# Altium schematic sheet AMC.SchDoc: AMC
size 420 x 297 mm; DocumentNumber: 1; SheetNumber: 7; SheetTotal: 15
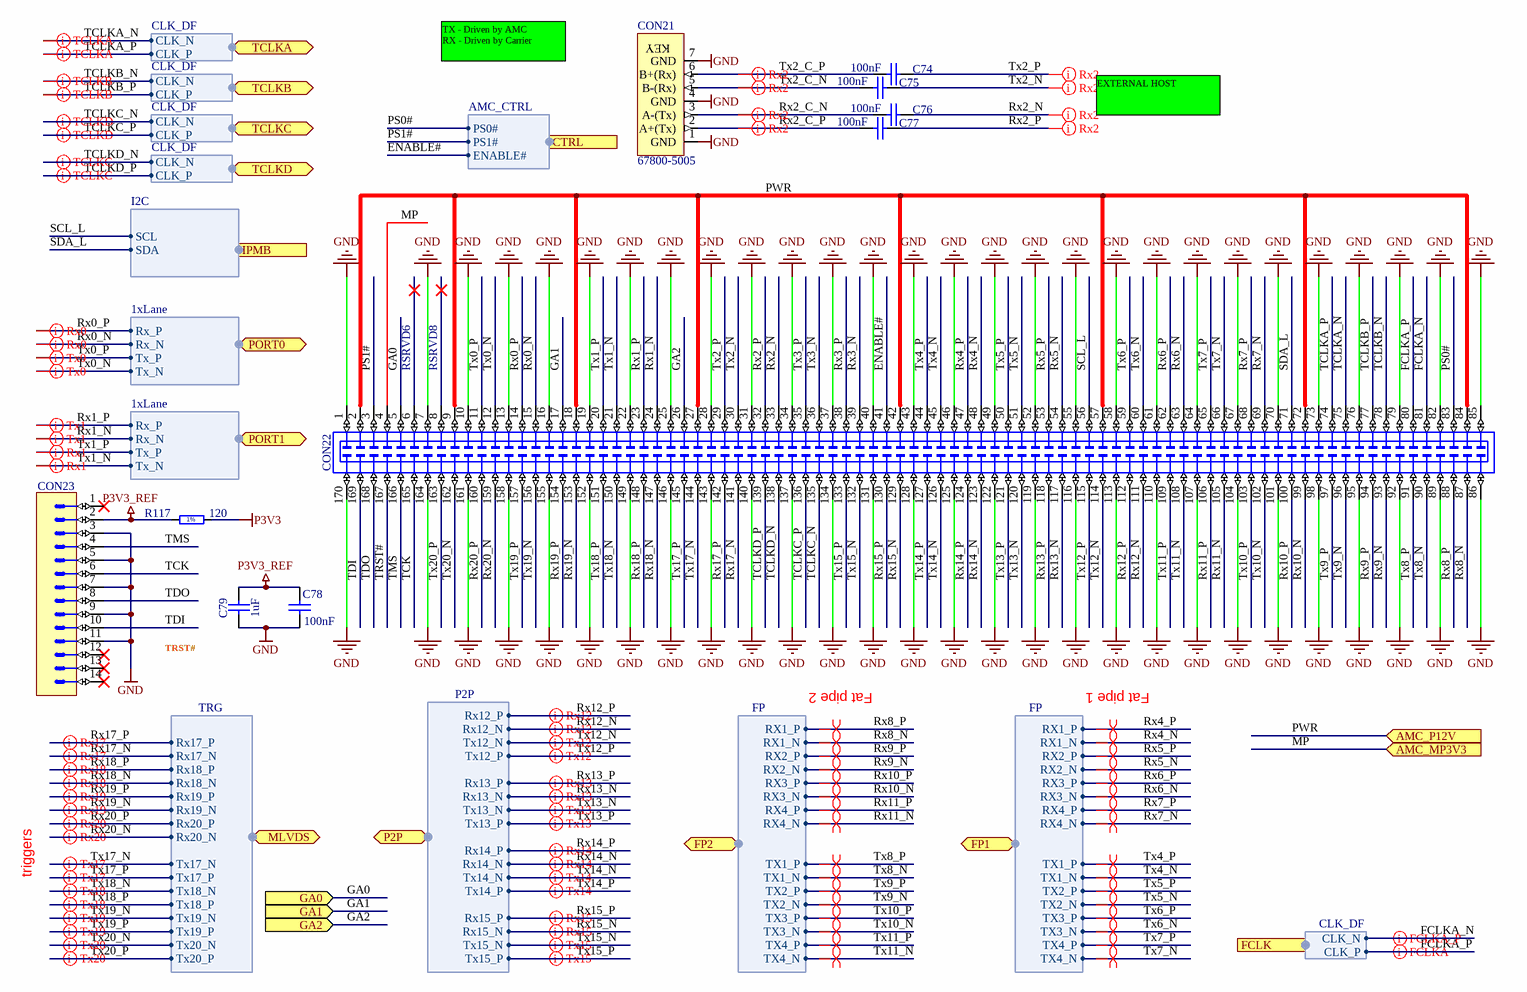
[diagram p0: AMC.SchDoc]

## Parts
C74  100nF  [CAPC0603X33N]
C75  100nF  [CAPC0603X33N]
C76  100nF  [CAPC0603X33N]
C77  100nF  [CAPC0603X33N]
C78  100nF  [CAPC0603X33N]
C79  1uF  [CAPC1608X87N]
CON21  67800-5005  [CON_SATA_V]
CON22  SAMTEC_MTCA-085-02-S-DV-SMT-K-TR  [SAMTEC_MTCA-085-02-S-DV-SMT-K-TR]  (value not drawn)
CON23  MOLEX_87832-1420  [MOLEX_87832-1420]  (value not drawn)
R117  120  [RESC1005X40N]

## Ports
AMC_MP3V3 (in), AMC_P12V (in), CTRL (harness AMC_CTRL), FCLK (harness CLK_DF), FP1 (harness FP), FP2 (harness FP), GA0 (in), GA1 (in), GA2 (in), IPMB (harness I2C), MLVDS (harness TRG), P2P (harness P2P), PORT0 (harness 1xLane), PORT1 (harness 1xLane), TCLKA (harness CLK_DF), TCLKB (harness CLK_DF), TCLKC (harness CLK_DF), TCLKD (harness CLK_DF)

## Harnesses
TRG: Rx17_P, Rx17_N, Rx18_P, Rx18_N, Rx19_P, Rx19_N, Rx20_P, Rx20_N, Tx17_N, Tx17_P, Tx18_N, Tx18_P, Tx19_N, Tx19_P, Tx20_N, Tx20_P
1xLane: Rx_P, Rx_N, Tx_P, Tx_N
FP: RX1_P, RX1_N, RX2_N, RX2_P, TX1_P, TX1_N, TX2_N, TX2_P, RX3_P, RX3_N, RX4_N, RX4_P, TX3_P, TX3_N, TX4_N, TX4_P
I2C: SCL, SDA
P2P: Rx12_P, Rx12_N, Tx12_N, Tx12_P, Rx13_P, Rx13_N, Tx13_N, Tx13_P, Rx14_P, Rx14_N, Tx14_N, Tx14_P, Rx15_P, Rx15_N, Tx15_N, Tx15_P
CLK_DF: CLK_P, CLK_N
AMC_CTRL: PS0#, PS1#, ENABLE#

## Nets
GND: C78.1 C79.1 CON21.1(GND) CON21.4(GND) CON21.7(GND) CON22.1 CON22.7 CON22.10 CON22.13 CON22.16 CON22.19 CON22.22 CON22.25 CON22.28 CON22.31 CON22.34 CON22.37 CON22.40 CON22.43 CON22.46 CON22.49 CON22.52 CON22.55 CON22.58 CON22.61 CON22.64 CON22.67 CON22.70 CON22.73 CON22.76 CON22.79 CON22.82 CON22.85 CON22.86 CON22.89 CON22.92 CON22.95 CON22.98 CON22.101 CON22.104 CON22.107 CON22.110 CON22.113 CON22.116 CON22.119 CON22.122 CON22.125 CON22.128 CON22.131 CON22.134 CON22.137 CON22.140 CON22.143 CON22.146 CON22.149 CON22.152 CON22.155 CON22.158 CON22.161 CON22.164 CON22.170 CON23.3 CON23.5 CON23.7 CON23.9 CON23.11
P3V3: R117.2
P3V3_REF: C78.2 C79.2 CON23.2 R117.1
ENABLE#: CON22.41 ; port CTRL.ENABLE#
FCLKA_N: CON22.81 ; port FCLK.CLK_N
FCLKA_P: CON22.80 ; port FCLK.CLK_P
GA0: CON22.5 ; port GA0
GA1: CON22.17 ; port GA1
GA2: CON22.26 ; port GA2
MP: CON22.4 ; port AMC_MP3V3
PS0#: CON22.83 ; port CTRL.PS0#
PS1#: CON22.3 ; port CTRL.PS1#
PWR: CON22.2 CON22.9 CON22.18 CON22.27 CON22.42 CON22.57 CON22.72 CON22.84 ; port AMC_P12V
Rx0_N: CON22.15 ; port PORT0.Rx_N
Rx0_P: CON22.14 ; port PORT0.Rx_P
Rx1_N: CON22.24 ; port PORT1.Rx_N
Rx1_P: CON22.23 ; port PORT1.Rx_P
Rx2_C_N: C76.1 CON21.3(A-(Tx))
Rx2_C_P: C77.1 CON21.2(A+(Tx))
Rx2_N: C76.2 CON22.33
Rx2_P: C77.2 CON22.32
Rx3_N: CON22.39
Rx3_P: CON22.38
Rx4_N: CON22.48 ; port FP1.RX1_N
Rx4_P: CON22.47 ; port FP1.RX1_P
Rx5_N: CON22.54 ; port FP1.RX2_N
Rx5_P: CON22.53 ; port FP1.RX2_P
Rx6_N: CON22.63 ; port FP1.RX3_N
Rx6_P: CON22.62 ; port FP1.RX3_P
Rx7_N: CON22.69 ; port FP1.RX4_N
Rx7_P: CON22.68 ; port FP1.RX4_P
Rx8_N: CON22.87 ; port FP2.RX1_N
Rx8_P: CON22.88 ; port FP2.RX1_P
Rx9_N: CON22.93 ; port FP2.RX2_N
Rx9_P: CON22.94 ; port FP2.RX2_P
Rx10_N: CON22.99 ; port FP2.RX3_N
Rx10_P: CON22.100 ; port FP2.RX3_P
Rx11_N: CON22.105 ; port FP2.RX4_N
Rx11_P: CON22.106 ; port FP2.RX4_P
Rx12_N: CON22.111 ; port P2P.Rx12_N
Rx12_P: CON22.112 ; port P2P.Rx12_P
Rx13_N: CON22.117 ; port P2P.Rx13_N
Rx13_P: CON22.118 ; port P2P.Rx13_P
Rx14_N: CON22.123 ; port P2P.Rx14_N
Rx14_P: CON22.124 ; port P2P.Rx14_P
Rx15_N: CON22.129 ; port P2P.Rx15_N
Rx15_P: CON22.130 ; port P2P.Rx15_P
Rx17_N: CON22.141 ; port MLVDS.Rx17_N
Rx17_P: CON22.142 ; port MLVDS.Rx17_P
Rx18_N: CON22.147 ; port MLVDS.Rx18_N
Rx18_P: CON22.148 ; port MLVDS.Rx18_P
Rx19_N: CON22.153 ; port MLVDS.Rx19_N
Rx19_P: CON22.154 ; port MLVDS.Rx19_P
Rx20_N: CON22.159 ; port MLVDS.Rx20_N
Rx20_P: CON22.160 ; port MLVDS.Rx20_P
SCL_L: CON22.56 ; port IPMB.SCL
SDA_L: CON22.71 ; port IPMB.SDA
TCK: CON22.165 CON23.6
TCLKA_N: CON22.75 ; port TCLKA.CLK_N
TCLKA_P: CON22.74 ; port TCLKA.CLK_P
TCLKB_N: CON22.78 ; port TCLKB.CLK_N
TCLKB_P: CON22.77 ; port TCLKB.CLK_P
TCLKC_N: CON22.135 ; port TCLKC.CLK_N
TCLKC_P: CON22.136 ; port TCLKC.CLK_P
TCLKD_N: CON22.138 ; port TCLKD.CLK_N
TCLKD_P: CON22.139 ; port TCLKD.CLK_P
TDI: CON22.169 CON23.10
TDO: CON22.168 CON23.8
TMS: CON22.166 CON23.4
TRST#: CON22.167
Tx0_N: CON22.12 ; port PORT0.Tx_N
Tx0_P: CON22.11 ; port PORT0.Tx_P
Tx1_N: CON22.21 ; port PORT1.Tx_N
Tx1_P: CON22.20 ; port PORT1.Tx_P
Tx2_C_N: C75.1 CON21.5(B-(Rx))
Tx2_C_P: C74.1 CON21.6(B+(Rx))
Tx2_N: C75.2 CON22.30
Tx2_P: C74.2 CON22.29
Tx3_N: CON22.36
Tx3_P: CON22.35
Tx4_N: CON22.45 ; port FP1.TX1_N
Tx4_P: CON22.44 ; port FP1.TX1_P
Tx5_N: CON22.51 ; port FP1.TX2_N
Tx5_P: CON22.50 ; port FP1.TX2_P
Tx6_N: CON22.60 ; port FP1.TX3_N
Tx6_P: CON22.59 ; port FP1.TX3_P
Tx7_N: CON22.66 ; port FP1.TX4_N
Tx7_P: CON22.65 ; port FP1.TX4_P
Tx8_N: CON22.90 ; port FP2.TX1_N
Tx8_P: CON22.91 ; port FP2.TX1_P
Tx9_N: CON22.96 ; port FP2.TX2_N
Tx9_P: CON22.97 ; port FP2.TX2_P
Tx10_N: CON22.102 ; port FP2.TX3_N
Tx10_P: CON22.103 ; port FP2.TX3_P
Tx11_N: CON22.108 ; port FP2.TX4_N
Tx11_P: CON22.109 ; port FP2.TX4_P
Tx12_N: CON22.114 ; port P2P.Tx12_N
Tx12_P: CON22.115 ; port P2P.Tx12_P
Tx13_N: CON22.120 ; port P2P.Tx13_N
Tx13_P: CON22.121 ; port P2P.Tx13_P
Tx14_N: CON22.126 ; port P2P.Tx14_N
Tx14_P: CON22.127 ; port P2P.Tx14_P
Tx15_N: CON22.132 ; port P2P.Tx15_N
Tx15_P: CON22.133 ; port P2P.Tx15_P
Tx17_N: CON22.144 ; port MLVDS.Tx17_N
Tx17_P: CON22.145 ; port MLVDS.Tx17_P
Tx18_N: CON22.150 ; port MLVDS.Tx18_N
Tx18_P: CON22.151 ; port MLVDS.Tx18_P
Tx19_N: CON22.156 ; port MLVDS.Tx19_N
Tx19_P: CON22.157 ; port MLVDS.Tx19_P
Tx20_N: CON22.162 ; port MLVDS.Tx20_N
Tx20_P: CON22.163 ; port MLVDS.Tx20_P

Not connected (* = marked no-connect by the designer): CON22 6* 8*; CON23 1* 12* 13* 14*

## Layout directives
differential pair: FCLKA_N, FCLKA_P, Rx0_N, Rx0_P, Rx1_N, Rx1_P, Rx2_C_N, Rx2_C_P, Rx2_N, Rx2_P, Rx4_N, Rx4_P, Rx5_N, Rx5_P, Rx6_N, Rx6_P, Rx7_N, Rx7_P, Rx8_N, Rx8_P, Rx9_N, Rx9_P, Rx10_N, Rx10_P, Rx11_N, Rx11_P, Rx12_N, Rx12_P, Rx13_N, Rx13_P, Rx14_N, Rx14_P, Rx15_N, Rx15_P, Rx17_N, Rx17_P, Rx18_N, Rx18_P, Rx19_N, Rx19_P, Rx20_N, Rx20_P, TCLKA_N, TCLKA_P, TCLKB_N, TCLKB_P, TCLKC_N, TCLKC_P, TCLKD_N, TCLKD_P, Tx0_N, Tx0_P, Tx1_N, Tx1_P, Tx2_C_N, Tx2_C_P, Tx2_N, Tx2_P, Tx4_N, Tx4_P, Tx5_N, Tx5_P, Tx6_N, Tx6_P, Tx7_N, Tx7_P, Tx8_N, Tx8_P, Tx9_N, Tx9_P, Tx10_N, Tx10_P, Tx11_N, Tx11_P, Tx12_N, Tx12_P, Tx13_N, Tx13_P, Tx14_N, Tx14_P, Tx15_N, Tx15_P, Tx17_N, Tx17_P, Tx18_N, Tx18_P, Tx19_N, Tx19_P, Tx20_N, Tx20_P

## Notes on the sheet
- TX - Driven by AMC
  RX - Driven by Carrier
- EXTERNAL HOST
- RSRVD6
- RSRVD8
- TRST#
- Fat pipe 2
- Fat pipe 1
- triggers
- Project/Equipment
- Document
- uTCA RTM 8 SFP+
- Designer
- Drawn by
- Check.by
- Copyright Creotech Instruments SA 2014.
  This documentation describes Open Hardware and is licensed under the CERN OHL v.1.1. You may redistribute and modify this documentation under the terms of the CERN OHL v.1.1. (http://ohwr.org/CERNOHL). This documentation is distributed WITHOUT ANY EXPRESS OR IMPLIED WARRANTY, INCLUDING OF MERCHANTABILITY, SATISFACTORY QUALITY AND FITNESS FOR A PARTICULAR PURPOSE. Please see the CERN OHL v.1.1 for applicable conditions.
- Creotech Instruments S.A.
- File
- Last Mod.
- Print Date
- Sheet
- Size
- A3
- of
- Rev
- (in symbol CON_SATA_V) KEY
- (in symbol R0402_120R_1%_0.0625W_100PPM) 1%

## Library data of the parts
C74-C78 = CC0201_100NF_6.3V_10%_X5R: Non-polarised capacitor; Part Description: SMD Multilayer Chip Ceramic Capacitor; Manufacturer: GENERIC; Manufacturer1 Part Number: 02016D104KAT2A; Voltage: 6.3V; TC: X5R; Tolerance: ±10%; Table: Capacitors SMD; Part Number: CC0201_100NF_6.3V_10%_X5R; Component Kind: Standard; Component Type: Standard; Pin Count: 2; Value: 100nF; Status: Not Recommended; Manufacturer Part Number: CC0201_100NF_6.3V_10%_X5R; Case: 0201; Mounted: Yes; Socket: No; SMD: Yes; Manufacturer1 Example: AVX; Manufacturer1 ComponentHeight: 0.33mm; HelpURL: \\cern.ch\dfs\Applications\Altium\Datasheets\CC0201_X5R_AVX.pdf; Author: CERN DEM JLC; CreateDate: 2007-12-03; LatestRevisionDate: 2007-12-03
C79 = CC0603_1UF_25V_10%_X7R: Non-polarised capacitor; Part Description: SMD Multilayer Chip Ceramic Capacitor; Manufacturer: GENERIC; Manufacturer1 Part Number: GRM188R71E105KA12D; Voltage: 25V; TC: X7R; Tolerance: ±10%; Table: Capacitors SMD; Part Number: CC0603_1UF_25V_10%_X7R; Component Kind: Standard; Component Type: Standard; Pin Count: 2; Value: 1uF; Status: None; Manufacturer Part Number: CC0603_1UF_25V_10%_X7R; Case: 0603; Mounted: Yes; Socket: No; SMD: Yes; Manufacturer1 Example: MURATA; Manufacturer1 ComponentHeight: 0.9mm; HelpURL: \\cern.ch\dfs\Applications\Altium\Datasheets\CC0603_X7R_MURATA.pdf; Author: CERN DEM JLC; CreateDate: 2011-01-18; LatestRevisionDate: 2011-01-18
CON21 = CON_SATA_V: SATA conenctor  PCB Molex
CON22 = SAMTEC_MTCA-085-02-S-DV-SMT-K-TR: 170 Poles,  Micro TCA (Telecom Computing Architecture) Edge Card Socket; Part Description: 170 Poles, Pitch 0.75mm, Micro TCA (Telecom Computing Architecture) Edge Card Socket; Manufacturer: SAMTEC; Part Number: SAMTEC_MTCA-085-02-S-DV-SMT-K-TR; Component Kind: Standard; Component Type: Standard; Pin Count: 170; Mounted: Yes; Socket: No; SMD: Yes; Status: None; Manufacturer Part Number: MTCA-085-02-S-DV-SMT-K-TR; ComponentHeight: 12.85mm; HelpURL: \\cern.ch\dfs\Applications\Altium\Datasheets\SAMTEC_MTCA-085-02-S-DV-SMT-K-TR.pdf; Author: CERN DEM JLC; CreateDate: 2012-08-15; LatestRevisionDate: 2012-08-15; Table: SAMTEC
CON23 = MOLEX_87832-1420: Connector 14 Male; Part Description: 2.00mm (.079") Pitch Milli-Grid™ Header, Surface Mount, Vertical, Shrouded, 14 Circuits,with Locking Windows and Centre Polarization Slot, PCB Locator; Manufacturer: MOLEX; Part Number: MOLEX_87832-1420; Component Kind: Standard; Component Type: Standard; Pin Count: 14; Family: Milli-Grid™; Mounted: Yes; Socket: No; SMD: Yes; Status: None; Manufacturer Part Number: 87832-1420; ComponentHeight: 6.4mm; HelpURL: \\cern.ch\dfs\Applications\Altium\Datasheets\MOLEX_87832-1420.pdf; Author: CERN DEM JLC; CreateDate: 2008-09-09; LatestRevisionDate: 2008-09-09; Table: MOLEX
R117 = R0402_120R_1%_0.0625W_100PPM: Resistor - 1%; Part Description: General Purpose Thick Film Chip Resistor; Manufacturer: GENERIC; Manufacturer1 Part Number: 232270671201L; TC: ±100ppm/°C; Table: Resistors SMD; Part Number: R0402_120R_1%_0.0625W_100PPM; Component Kind: Standard; Component Type: Standard; Pin Count: 2; Value: 120; Status: Not recommended; Power: 0.0625W; Tolerance: ±1%; Manufacturer Part Number: R0402_120R_1%_0.0625W_100PPM; Case: 0402; Mounted: Yes; Socket: No; SMD: Yes; Manufacturer1 Example: YAGEO PHYCOMP; Manufacturer1 ComponentHeight: 0.4mm; HelpURL: \\cern.ch\dfs\Applications\Altium\Datasheets\R0402_Phycomp_RC0402.pdf; Author: CERN DEM JLC; CreateDate: 2007-12-03; LatestRevisionDate: 2012-10-17